# Altium schematic sheet Pressure_Sensors.SchDoc: Pressure Sensors
size A4; Organization: Badgerloop Electrical; Address1: 133 Engineering Research Building; Address2: 1500 Engineering Drive; Address3: Madison, Wi 53706
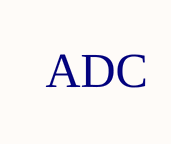
[diagram p0: Pressure_Sensors.SchDoc]

## Notes on the sheet
- ADC
- Title
- Engineer:
- Date:
- Time:
- Revision:
- Sheet
- of
- File: